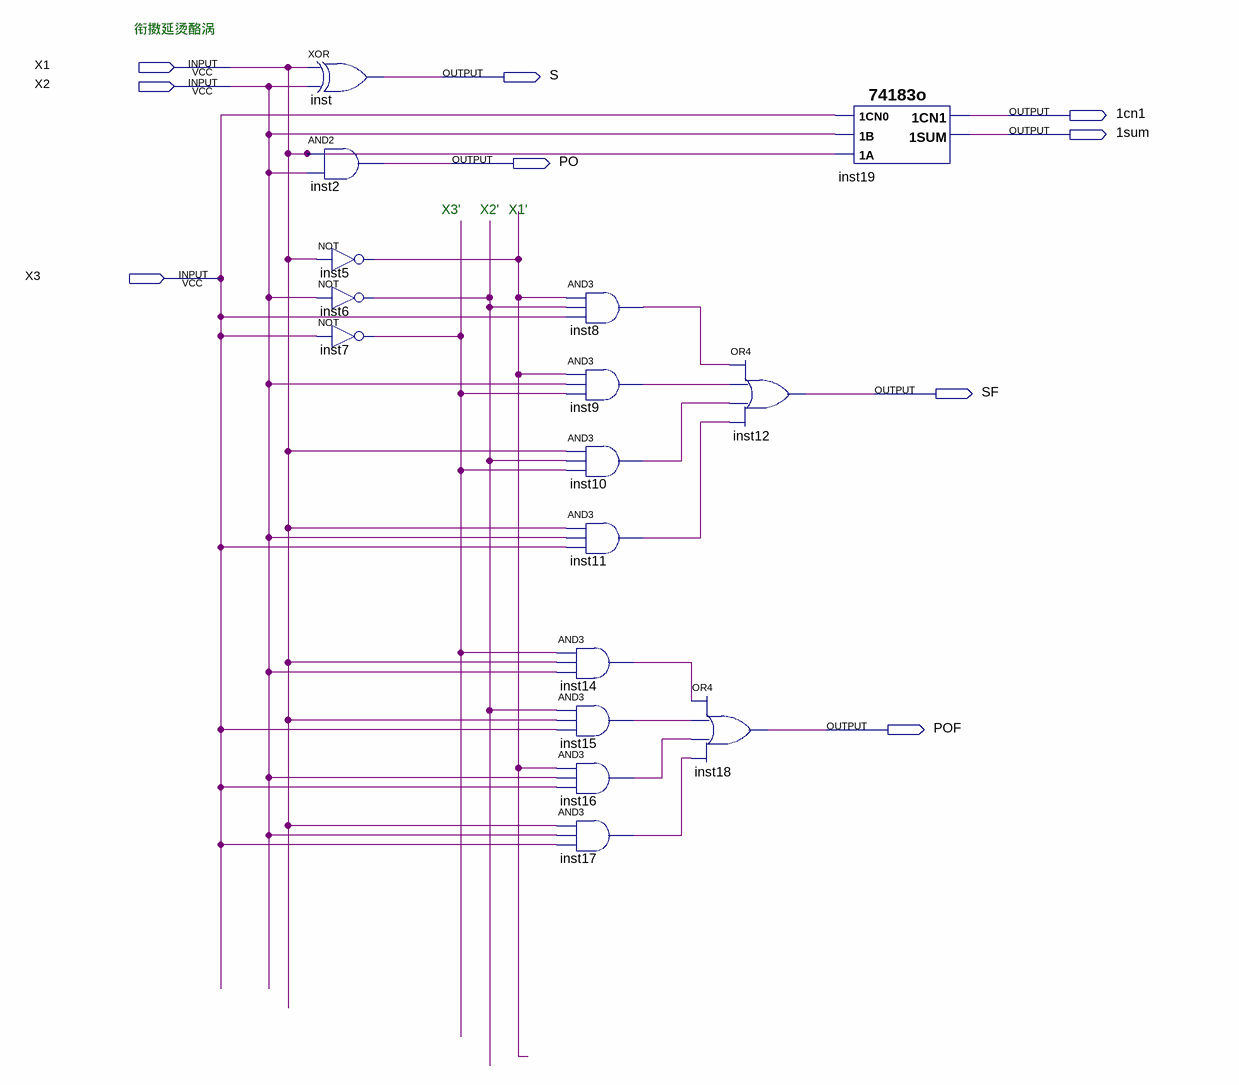
[diagram p0: schematic sheet]
// Quartus schematic cmb4.bdf as structural Verilog: 16 symbols, 9 pins
module cmb4 (
  input  X1,
  input  X2,
  input  X3,
  output S,
  output \1cn1 ,
  output \1sum ,
  output PO,
  output SF,
  output POF
);

  wire inst5_out, inst6_out, inst7_out, inst8_out, inst9_out, inst10_out, inst11_out, inst14_out, inst15_out,
       inst16_out, inst17_out;

  xor inst (S, X1, X2);
  and inst2 (PO, X1, X2);
  not inst5 (inst5_out, X1);
  not inst6 (inst6_out, X2);
  not inst7 (inst7_out, X3);
  and inst8 (inst8_out, inst5_out, inst6_out, X3);
  and inst9 (inst9_out, inst5_out, X2, inst7_out);
  and inst10 (inst10_out, X1, inst6_out, inst7_out);
  and inst11 (inst11_out, X1, X2, X3);
  and inst14 (inst14_out, inst7_out, X1, X2);
  and inst15 (inst15_out, inst6_out, X1, X3);
  and inst16 (inst16_out, inst5_out, X2, X3);
  and inst17 (inst17_out, X1, X2, X3);
  or inst18 (POF, inst14_out, inst15_out, inst16_out, inst17_out);
  or inst12 (SF, inst8_out, inst9_out, inst10_out, inst11_out);
  \74183o  inst19 (.\1CN0 (X3), .\1A (X1), .\1B (X2), .\1CN1 (\1cn1 ), .\1SUM (\1sum ));

  // Notes on the sheet:
  //   衔擞延烫酪涡
  //   X3'
  //   X2'
  //   X1'
endmodule
